# Altium schematic sheet power_supply.SchDoc
size A4
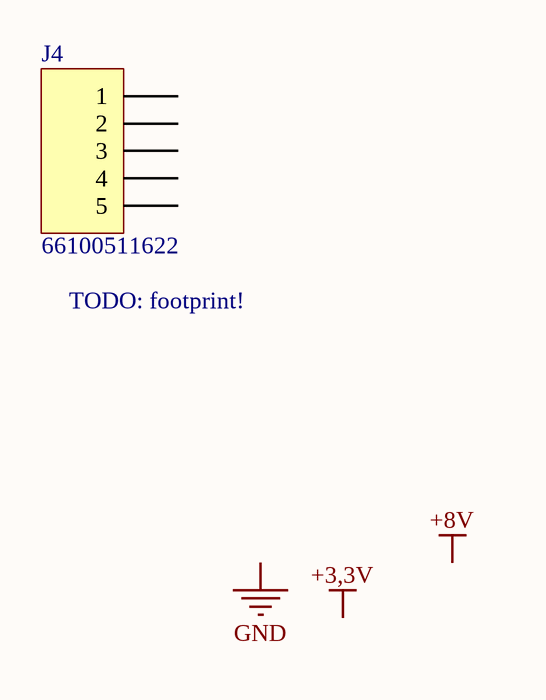
[diagram p0: power_supply.SchDoc]

## Parts
J4  66100511622  [66100511622]

## Nets

Not connected (* = marked no-connect by the designer): J4 1 2 3 4 5

## Notes on the sheet
- (near J4) TODO: footprint!
- Labels drawn without touching a wire or pin: +3,3V, +8V, GND

## Library data of the parts
J4 = WE-2.54 mm Pitch 66100511622: WR-WTB 2.54mm Shrouded Header_Straight; Manufacturer: Wurth Elektronik; ComponentLink1 Description: Manufacturer; ComponentLink2 Description: Datasheet; NoPins: 5; Created Date: 21.Sep.2015; partNo: 66100511622; ComponentLink1URL: http://www.we-online.com; Created by: Baojun Chen